# EAGLE schematic touch_brick (EAGLE 7.2.0)
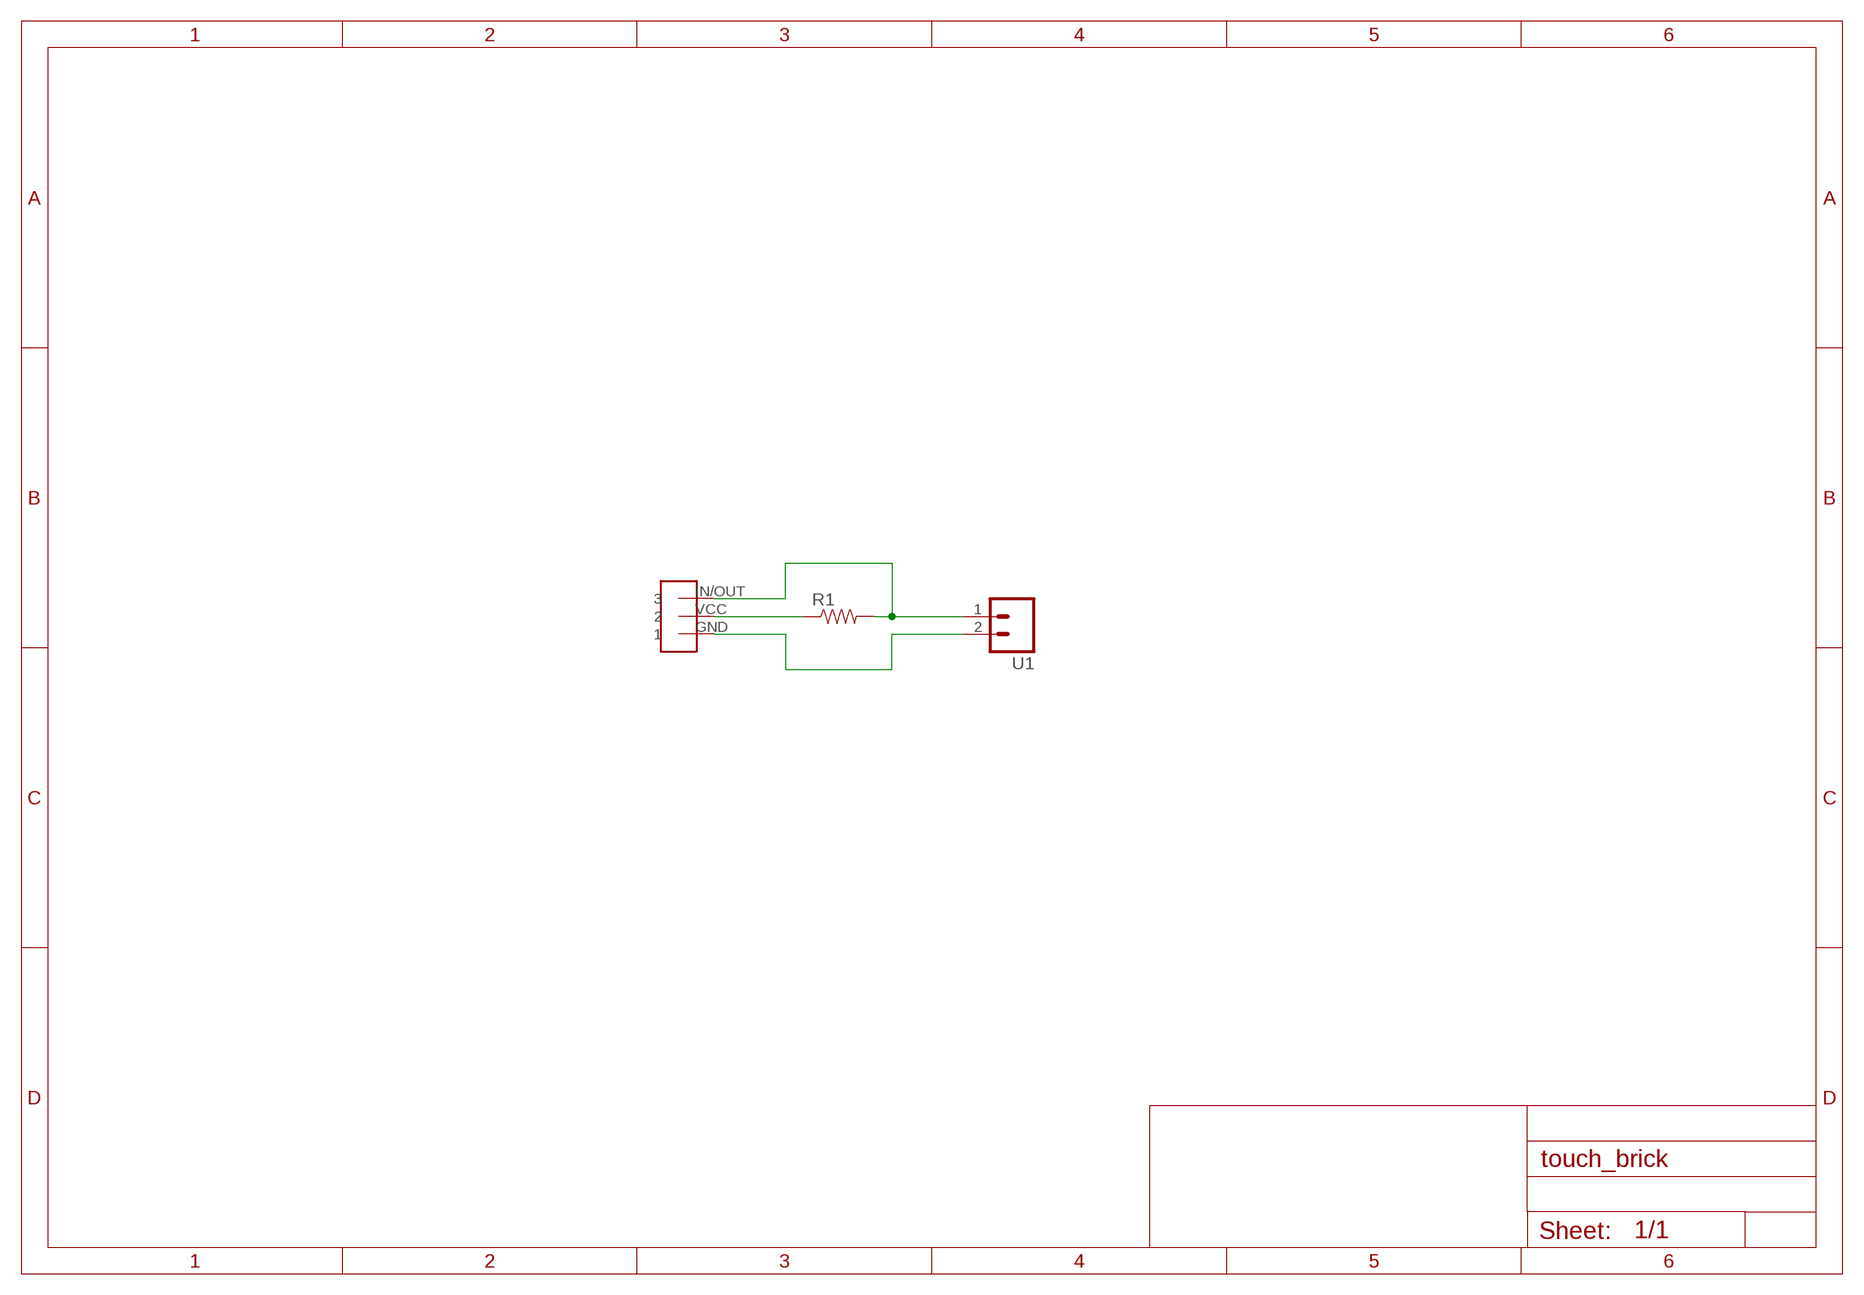
[diagram p0: schematic, sheet 1]

## Parts
R1  RESISTORKIT  [AXIAL-0.3-KIT]
U1  M02LOCK  [1X02_LOCK]
U$1  BRICK-3PIN  [BRICK_3PIN]

## Nets
GND: U1.2 U$1.GND
N$1: R1.P$2 U1.1 U$1.IN/OUT
N$2: R1.P$1 U$1.VCC

## Library data of the parts
R1 = SparkFun:RESISTOR: Resistor Basic schematic elements and footprints for 0603, 1206, and PTH resistors.
U1 = SparkFun:M02: Header 2 Standard 2-pin 0.1" header. Use with straight break away headers (SKU : PRT-00116), right angle break away headers (PRT-00553), swiss pins (PRT-00743), machine pins (PRT-00117), and female headers (PRT-00115). Molex polarized connector foot print use with SKU : PRT-08233 with associated crimp pins and housings.
U$1 = gclue:BRICK-3PIN